# EAGLE design Z05_MB_01 (EAGLE 6.3)
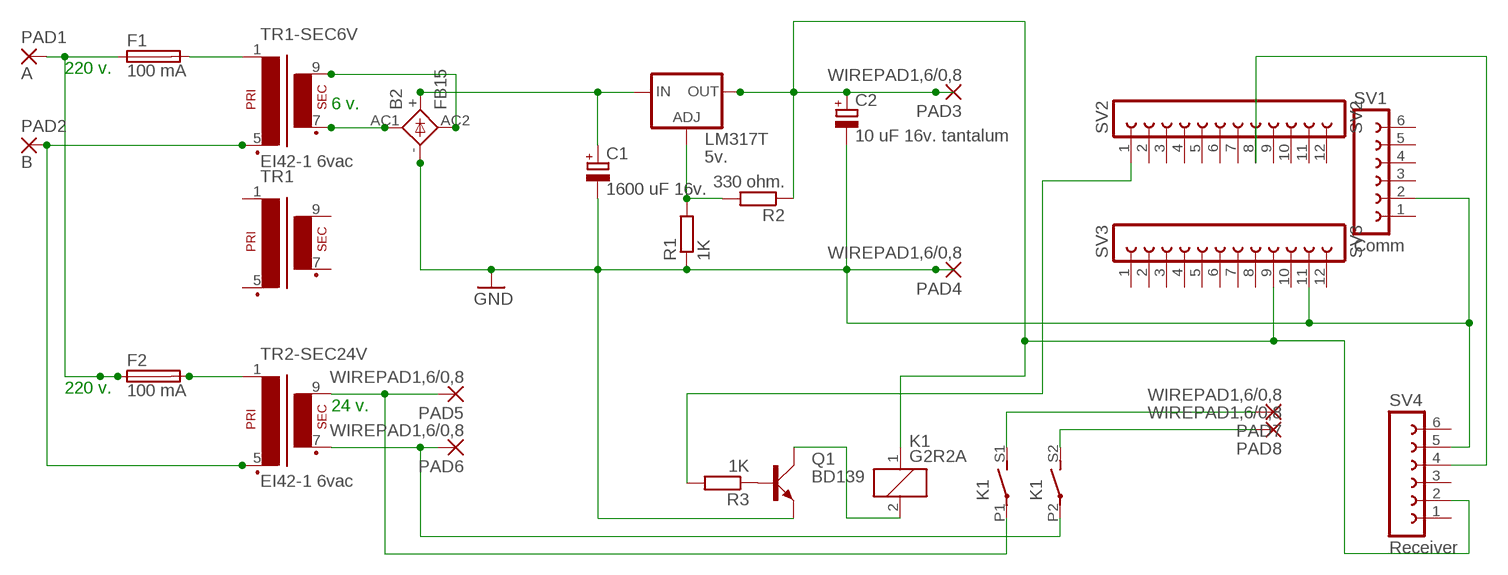
[diagram p0: schematic, sheet 1]

## Parts
B2  FB15  [FB15]
C1  1600 uF 16v.  CPOL-EUE5-13  [E5-13]
C2  10 uF 16v. tantalum  CPOL-EUTAP5-60  [TAP5-60]
F1  100 mA  GSH15  [GSH15]
F2  100 mA  GSH15  [GSH15]
K1  G2R2A  [G2R2A]
LM317T  5v.  LM317TS  [317TS]
PAD1  A  2,54/1,1  [2,54/1,1]
PAD2  B  2,54/1,1  [2,54/1,1]
PAD3  WIREPAD1,6/0,8  [1,6/0,8]
PAD4  WIREPAD1,6/0,8  [1,6/0,8]
PAD5  WIREPAD1,6/0,8  [1,6/0,8]
PAD6  WIREPAD1,6/0,8  [1,6/0,8]
PAD7  WIREPAD1,6/0,8  [1,6/0,8]
PAD8  WIREPAD1,6/0,8  [1,6/0,8]
Q1  BD139  [TO126AV]
R1  1K  R-EU_0207/12  [0207/12]
R2  330 ohm.  R-EU_0207/12  [0207/12]
R3  1K  R-EU_0207/12  [0207/12]
SV1  Comm  FE06-1  [FE06]
SV2  SV2  FE12-1  [FE12]
SV3  SV3  FE12-1  [FE12]
SV4  Receiver  FE06-1  [FE06]
TR1  EI30-1  [EI30-1]
TR1-SEC6V  EI42-1 6vac  EI42-1  [EI42-1]
TR2-SEC24V  EI42-1 6vac  EI42-1  [EI42-1]

## Nets
GND: B2.- C1.- C2.- PAD4.1(P) Q1.E R1.1 SV1.2 SV3.11 SV4.5
N$1: F1.2 TR1-SEC6V.1
N$2: B2.AC1 TR1-SEC6V.7(S3)
N$3: B2.+ C1.+ LM317T.3(IN)
N$4: K1.P1(2:P) PAD5.1(P) TR2-SEC24V.9(S4)
N$5: C2.+ K1.1 LM317T.2(OUT) PAD3.1(P) R2.1 SV3.9 SV4.2
N$6: LM317T.1(ADJ) R1.2 R2.2
N$7: F1.1 F2.1 PAD1.1(P)
N$8: PAD2.1(P) TR1-SEC6V.5(P2) TR2-SEC24V.5(P2)
N$9: K1.P2(3:P) PAD6.1(P) TR2-SEC24V.7(S3)
N$10: B2.AC2 TR1-SEC6V.9(S4)
N$11: F2.2 TR2-SEC24V.1
N$12: Q1.B R3.1
N$13: K1.2 Q1.C
N$14: K1.S2(3:S) PAD8.1(P)
N$15: K1.S1(2:S) PAD7.1(P)
N$16: R3.2 SV2.1
N$17: SV2.8 SV4.4
Unconnected: SV1.1 SV1.3 SV1.4 SV1.5 SV1.6 SV2.2 SV2.3 SV2.4 SV2.5 SV2.6 SV2.7 SV2.9 SV2.10 SV2.11 SV2.12 SV3.1 SV3.2 SV3.3 SV3.4 SV3.5 SV3.6 SV3.7 SV3.8 SV3.10 SV3.12 SV4.1 SV4.3 SV4.6 TR1.1 TR1.5(P2) TR1.7(S3) TR1.9(S4)

## Notes on the sheet
- 220 v.
- 6 v.
- 220 v.
- 24 v.

## Library data of the parts
B2 = rectifier:FB15: FAGOR RECTIFIER grid 3 x 5 mm; OC_FARNELL: unknown
C1 C2 = rcl:CPOL-EU: POLARIZED CAPACITOR, European symbol; OC_FARNELL: unknown
F1 F2 = fuse:GSH15: FUSE HOLDER grid 15mm, 19649 Wickmann; MPN: 64900001039; OC_FARNELL: 1271673; OC_NEWARK: 02P0318
K1 = relay:G2R2A: RELAY 2 x norm. open, Omron; MPN: G2R-2A-DC24; OC_FARNELL: 6985269; OC_NEWARK: 36M5257
LM317T = v-reg:LM317TS: VOLTAGE REGULATOR; OC_FARNELL: unknown
PAD1 PAD2 = wirepad:2,54/1,1: THROUGH-HOLE PAD
PAD3-PAD8 = wirepad:WIREPAD: Wire PAD connect wire on PCB
Q1 = transistor-power:BD139: NPN TRANSISTOR
R1-R3 = rcl:R-EU_: RESISTOR, European symbol
SV1 SV4 = con-lsta:FE06-1: FEMALE HEADER; OC_FARNELL: unknown; OC_NEWARK: unknown
SV2 SV3 = con-lsta:FE12-1: FEMALE HEADER; OC_FARNELL: unknown; OC_NEWARK: unknown
TR1 = trafo:EI30-1: TRANSFORMER 1 primary winding, 1 secondary winding ERA
TR1-SEC6V TR2-SEC24V = trafo:EI42-1: TRANSFORMER 1 primary winding, 1 secondary winding ERA; OC_FARNELL: unknown

## Board
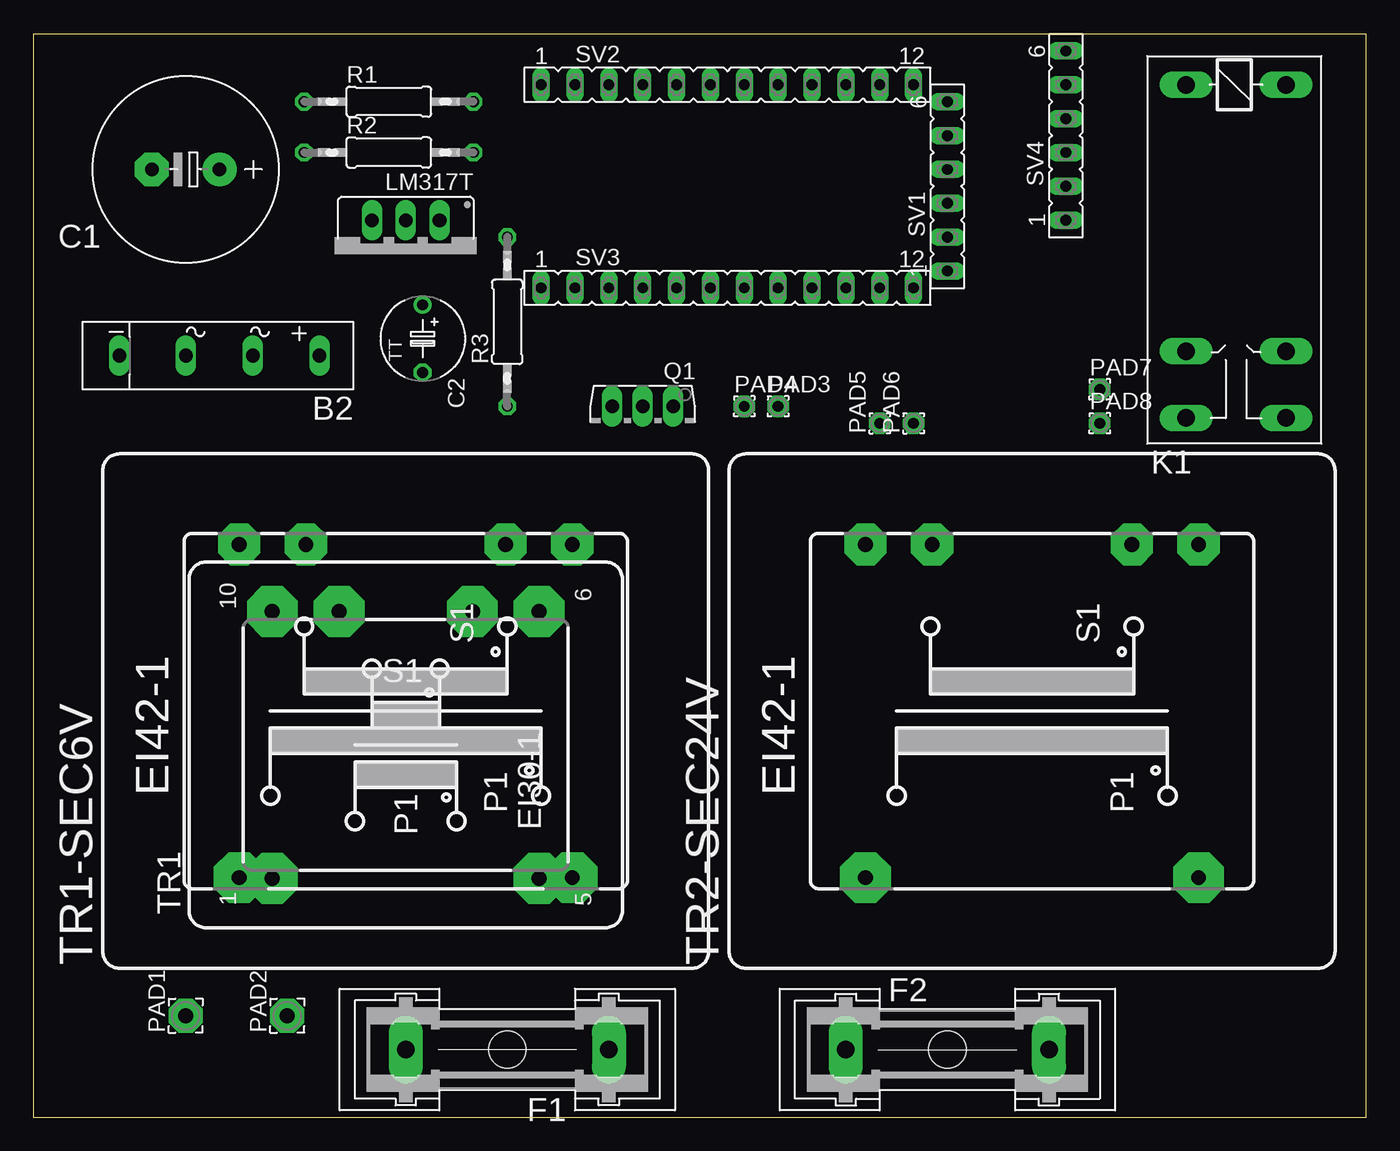
[diagram p1: board, top side]
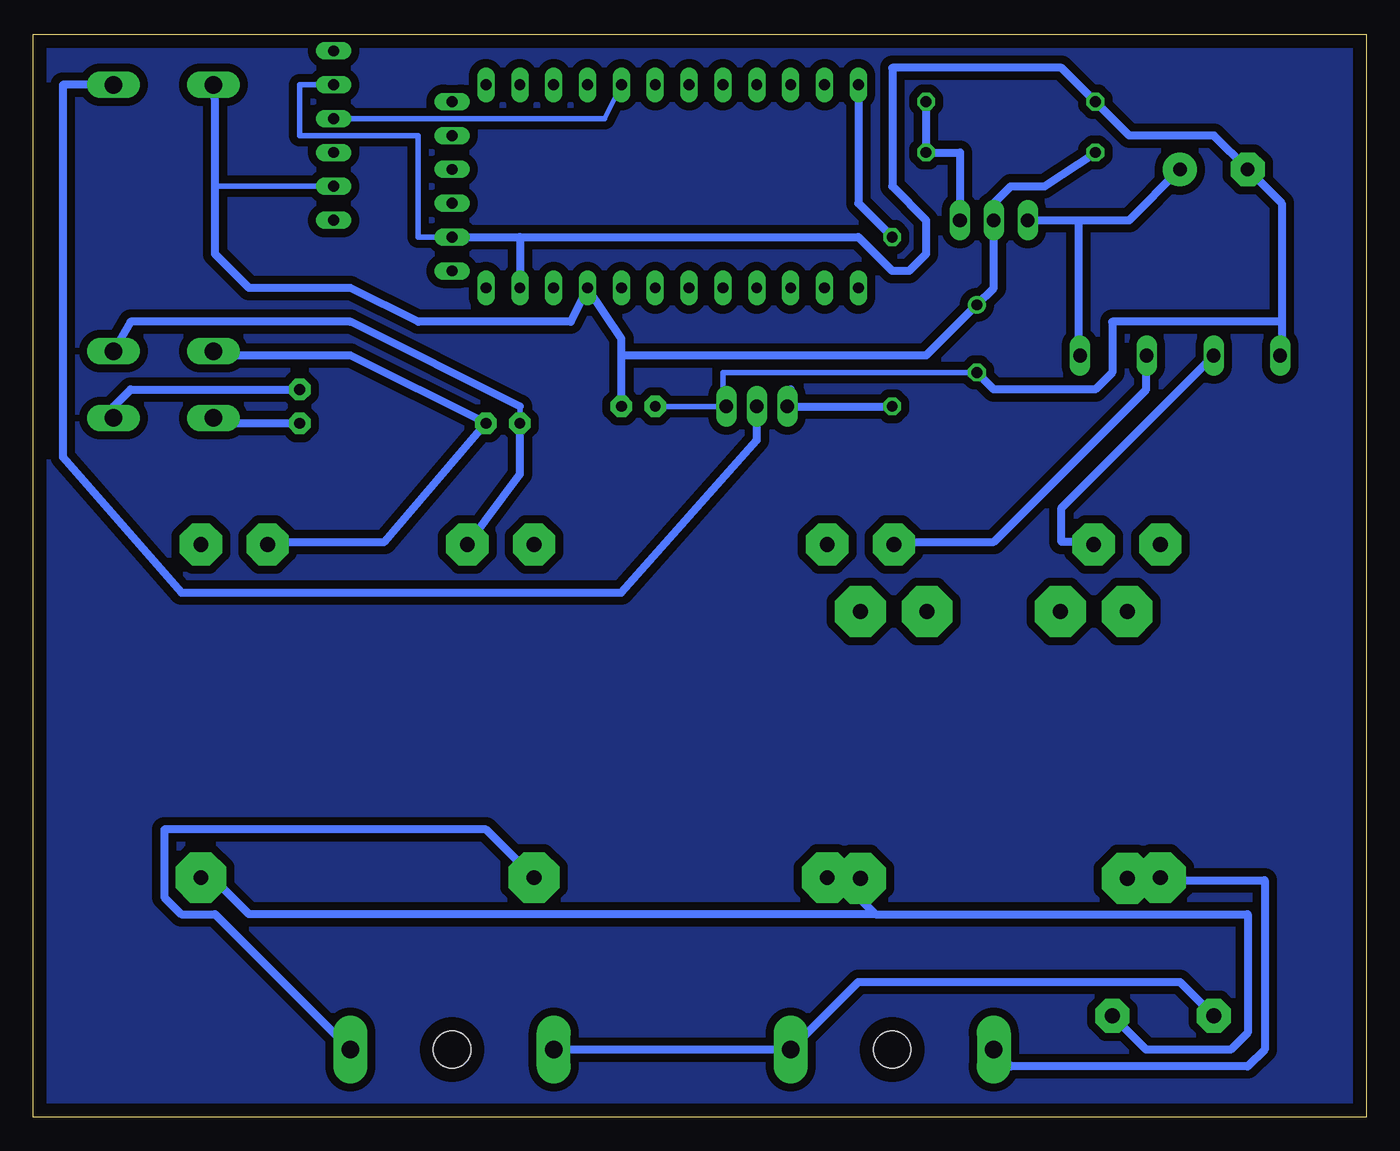
[diagram p2: board, bottom side, seen from below]

Size 100 x 81.27 mm. Coordinates in mm from the lower left corner, seen from the top.
Outline: 0,0 100,0 100,81.27 0,81.27 0,0
Copper layers (1*16): Top 0mil / dielectric 1.5mm / Bottom 0.035mm
Design rules "default *": minimum track width 16mil, minimum drill 16mil, track to track 24mil, track to pad 24mil, pad to pad 16mil, via to via 16mil, smd to smd 8mil, copper to edge 40mil, drill to drill 8mil, minimum pad ring 10mil, minimum via ring 8mil, stop-mask expansion 4mil, vias tented up to drill 0mil, thermal gap 10mil

### Footprints (pad centres in the part's own frame; a part is rotated, then mirrored left to right if it is on the bottom)
FB15 = drill 1.016 long: + -7.5,0; - 7.511,0; AC1 -2.496,0; AC2 2.533,0
E5-13 = drill 1.016 pad 2.54: + -2.54,0 | drill 1.016 pad 2.54 octagon: - 2.54,0
TAP5-60 = drill 0.813: + -2.54,0 | drill 0.813 octagon: - 2.54,0
GSH15 = drill 1.321 pad 2.54 long: 1 -7.62,0; 2 7.62,0 | hole 2.794: 0,0
G2R2A = drill 1.321 long: 1 -2.54,-3.683; 2 -2.54,3.81; P1 17.45,3.81; P2 17.45,-3.683; S1 22.454,3.81; S2 22.454,-3.683
317TS = drill 1.016 long: 1 -2.54,-2.54; 2 0,-2.54; 3 2.54,-2.54
2,54/1,1 = drill 1.118 pad 2.54 octagon: 1 0,0
1,6/0,8 = drill 0.813 pad 1.6 octagon: 1 0,0
TO126AV = drill 1.016 long: B 2.286,-1.27; C 0,-1.27; E -2.286,-1.27
0207/12 = drill 0.813 octagon: 1 -6.35,0; 2 6.35,0
FE06 = drill 0.813 long: 1 -6.35,0; 2 -3.81,0; 3 -1.27,0; 4 1.27,0; 5 3.81,0; 6 6.35,0
FE12 = drill 0.813 long: 1 -13.97,0; 2 -11.43,0; 3 -8.89,0; 4 -6.35,0; 5 -3.81,0; 6 -1.27,0; 7 1.27,0; 8 3.81,0; 9 6.35,0; 10 8.89,0; 11 11.43,0; 12 13.97,0
EI30-1 = drill 1.118 pad 3.81 octagon: 1 -10.008,10.008; 5 -10.008,-10.008; 6 10.008,-10.008; 7 10.008,-5.004; 9 10.008,5.004; 10 10.008,10.008
EI42-1 = drill 1.118 pad 3.81 octagon: 1 -12.497,12.497; 5 -12.497,-12.497 | drill 1.118 pad 3.175 octagon: 6 12.497,-12.497; 7 12.497,-7.493; 9 12.497,7.493; 10 12.497,12.497

### Placement (x,y rotation side)
B2  13.97,57.15 180 top
C1  11.43,71.12 180 top
C2  29.21,58.42 270 top
F1  35.56,5.08 180 top
F2  68.58,5.08 0 top
K1  90.17,74.93 270 top
LM317T  27.94,64.77 180 top
PAD1  11.43,7.62 90 top
PAD2  19.05,7.62 90 top
PAD3  55.88,53.34 0 top
PAD4  53.34,53.34 0 top
PAD5  63.5,52.07 90 top
PAD6  66.04,52.07 90 top
PAD7  80.01,54.61 0 top
PAD8  80.01,52.07 0 top
Q1  45.72,52.07 180 top
R1  26.67,76.2 0 top
R2  26.67,72.39 0 top
R3  35.56,59.69 90 top
SV1  68.58,69.85 90 top
SV2  52.07,77.47 0 top
SV3  52.07,62.23 0 top
SV4  77.47,73.66 90 top
TR1  27.94,27.94 90 top
TR1-SEC6V  27.94,30.48 90 top
TR2-SEC24V  74.93,30.48 90 top

### Tracks (layer width: path | path; a pad name or v marks a point on that pad's centre or on a via)
GND
  Bottom 0.406: SV1.2 71.12,66.04 71.12,73.66 80.01,73.66 80.01,77.47 SV4.5 | PAD4.1 48.26,53.34 48.26,55.88 C2.-
  Bottom 0.61: 48.26,53.34 Q1.E | 6.35,59.69 6.35,68.58 C1.- 11.43,73.66 17.78,73.66 R1.1 22.86,78.74 35.56,78.74 35.56,69.85 33.02,67.31 33.02,64.77 34.29,63.5 35.56,63.5 38.1,66.04 63.5,66.04 | 6.35,59.69 6.35,57.15 B2.- | C2.- 27.94,54.61 20.32,54.61 19.05,55.88 19.05,59.69 6.35,59.69 | SV1.2 63.5,66.04 | 63.5,66.04 SV3.11
N$1
  Bottom 0.61: F1.2 26.67,3.81 8.89,3.81 7.62,5.08 7.62,17.78 15.24,17.78 TR1-SEC6V.1
N$2
  Bottom 0.61: B2.AC1 16.51,57.15 16.51,54.61 27.94,43.18 34.29,43.18 TR1-SEC6V.7
N$3
  Bottom 0.61: 21.59,67.31 21.59,57.15 B2.+ | LM317T.3 21.59,67.31 | C1.+ 17.78,67.31 21.59,67.31
N$4
  Bottom 0.406: 63.5,53.34 PAD5.1
  Bottom 0.61: PAD5.1 63.5,48.26 TR2-SEC24V.9 | 63.5,53.34 76.2,59.69 92.71,59.69 K1.P1
N$5
  Bottom 0.406: 86.36,69.85 SV4.2
  Bottom 0.61: R2.1 24.13,69.85 26.67,69.85 27.94,68.58 LM317T.2 27.94,62.23 C2.+ 33.02,57.15 55.88,57.15 | PAD3.1 55.88,57.15 | 55.88,57.15 55.88,58.42 SV3.9 59.69,59.69 71.12,59.69 76.2,62.23 83.82,62.23 86.36,64.77 86.36,69.85 86.36,76.2 K1.1
N$6
  Bottom 0.61: R1.2 R2.2 30.48,72.39 LM317T.1
N$7
  Bottom 0.61: PAD1.1 13.97,10.16 38.1,10.16 F1.1 F2.1
N$8
  Bottom 0.61: PAD2.1 16.51,5.08 10.16,5.08 8.89,6.35 8.89,15.24 36.83,15.24 | 36.83,15.24 39.37,17.78 TR1-SEC6V.5 | 36.83,15.24 83.82,15.24 86.36,17.78 TR2-SEC24V.5
N$9
  Bottom 0.61: TR2-SEC24V.7 81.28,43.18 73.66,43.18 PAD6.1 76.2,57.15 85.09,57.15 K1.P2
N$10
  Bottom 0.61: B2.AC2 22.86,45.72 22.86,43.18 21.59,43.18 TR1-SEC6V.9
N$11
  Bottom 0.61: F2.2 86.36,15.24 88.9,15.24 90.17,16.51 90.17,21.59 66.04,21.59 TR2-SEC24V.1
N$12
  Bottom 0.61: R3.1 Q1.B 43.18,54.61
N$13
  Bottom 0.61: Q1.C 45.72,50.8 55.88,39.37 88.9,39.37 97.79,49.53 97.79,77.47 K1.2
N$14
  Bottom 0.61: PAD8.1 86.36,52.07 K1.S2
N$15
  Bottom 0.61: PAD7.1 92.71,54.61 93.98,53.34 K1.S1
N$16
  Bottom 0.61: R3.2 38.1,68.58 SV2.1
N$17
  Bottom 0.406: SV2.8 57.15,74.93 SV4.4
N$18
  pour Bottom: 0,81.28 100.33,81.28 100.33,0 0,0